# EAGLE design EIB A79024-001 (EAGLE 9.3.2)
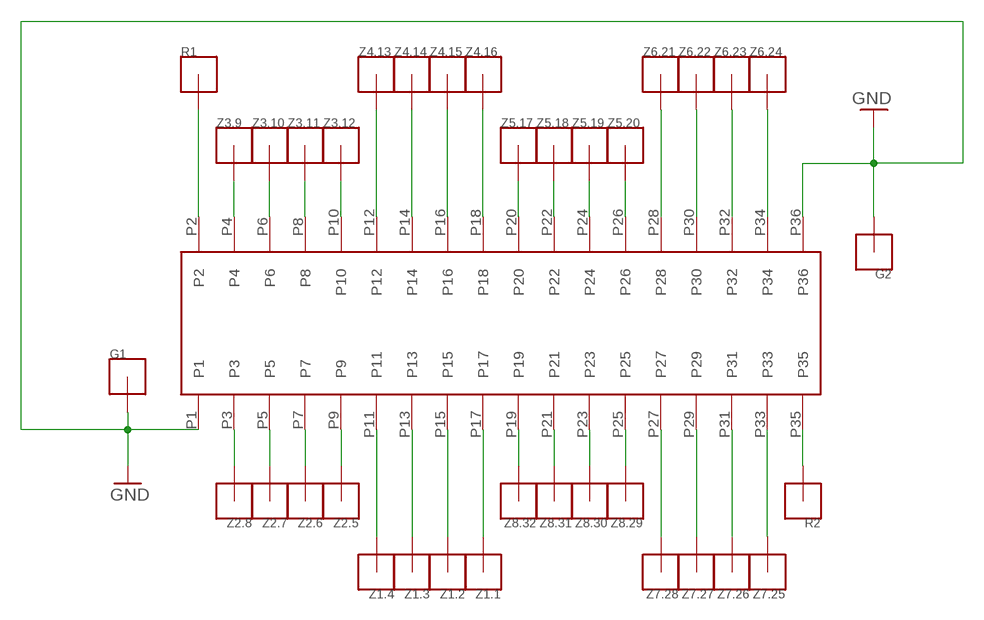
[diagram p0: schematic, sheet 1]

## Parts
A79024  OMNETICS  [A79024]
G1  S_P_HOLE  [S_P_HOLE]
G2  S_P_HOLE  [S_P_HOLE]
R1  S_P_HOLE  [S_P_HOLE]
R2  S_P_HOLE  [S_P_HOLE]
Z1.1  S_P_HOLE  [S_P_HOLE]
Z1.2  S_P_HOLE  [S_P_HOLE]
Z1.3  S_P_HOLE  [S_P_HOLE]
Z1.4  S_P_HOLE  [S_P_HOLE]
Z2.5  S_P_HOLE  [S_P_HOLE]
Z2.6  S_P_HOLE  [S_P_HOLE]
Z2.7  S_P_HOLE  [S_P_HOLE]
Z2.8  S_P_HOLE  [S_P_HOLE]
Z3.9  S_P_HOLE  [S_P_HOLE]
Z3.10  S_P_HOLE  [S_P_HOLE]
Z3.11  S_P_HOLE  [S_P_HOLE]
Z3.12  S_P_HOLE  [S_P_HOLE]
Z4.13  S_P_HOLE  [S_P_HOLE]
Z4.14  S_P_HOLE  [S_P_HOLE]
Z4.15  S_P_HOLE  [S_P_HOLE]
Z4.16  S_P_HOLE  [S_P_HOLE]
Z5.17  S_P_HOLE  [S_P_HOLE]
Z5.18  S_P_HOLE  [S_P_HOLE]
Z5.19  S_P_HOLE  [S_P_HOLE]
Z5.20  S_P_HOLE  [S_P_HOLE]
Z6.21  S_P_HOLE  [S_P_HOLE]
Z6.22  S_P_HOLE  [S_P_HOLE]
Z6.23  S_P_HOLE  [S_P_HOLE]
Z6.24  S_P_HOLE  [S_P_HOLE]
Z7.25  S_P_HOLE  [S_P_HOLE]
Z7.26  S_P_HOLE  [S_P_HOLE]
Z7.27  S_P_HOLE  [S_P_HOLE]
Z7.28  S_P_HOLE  [S_P_HOLE]
Z8.29  S_P_HOLE  [S_P_HOLE]
Z8.30  S_P_HOLE  [S_P_HOLE]
Z8.31  S_P_HOLE  [S_P_HOLE]
Z8.32  S_P_HOLE  [S_P_HOLE]

## Nets
GND: A79024.P1 A79024.P36 G1.P1 G2.P1
N$1: A79024.P28 Z6.21.P1
N$2: A79024.P32 Z6.23.P1
N$3: A79024.P34 Z6.24.P1
N$4: A79024.P30 Z6.22.P1
N$5: A79024.P4 Z3.9.P1
N$6: A79024.P6 Z3.10.P1
N$7: A79024.P8 Z3.11.P1
N$8: A79024.P10 Z3.12.P1
N$9: A79024.P12 Z4.13.P1
N$10: A79024.P14 Z4.14.P1
N$11: A79024.P16 Z4.15.P1
N$12: A79024.P18 Z4.16.P1
N$13: A79024.P20 Z5.17.P1
N$14: A79024.P22 Z5.18.P1
N$15: A79024.P24 Z5.19.P1
N$16: A79024.P26 Z5.20.P1
N$17: A79024.P2 R1.P1
N$18: A79024.P35 R2.P1
N$19: A79024.P3 Z2.8.P1
N$20: A79024.P5 Z2.7.P1
N$21: A79024.P7 Z2.6.P1
N$22: A79024.P9 Z2.5.P1
N$23: A79024.P11 Z1.4.P1
N$24: A79024.P13 Z1.3.P1
N$25: A79024.P15 Z1.2.P1
N$26: A79024.P17 Z1.1.P1
N$27: A79024.P19 Z8.32.P1
N$28: A79024.P21 Z8.31.P1
N$29: A79024.P23 Z8.30.P1
N$30: A79024.P25 Z8.29.P1
N$31: A79024.P27 Z7.28.P1
N$32: A79024.P29 Z7.27.P1
N$33: A79024.P31 Z7.26.P1
N$63: A79024.P33 Z7.25.P1

## Library data of the parts
A79024 = omnetics:OMNETICS
G1 G2 R1 R2 Z1.1-Z1.4 Z2.5-Z2.8 Z3.9-Z3.12 Z4.13-Z4.16 Z5.17-Z5.20 Z6.21-Z6.24 Z7.25-Z7.28 Z8.29-Z8.32 = omnetics:S_P_HOLE

## Board
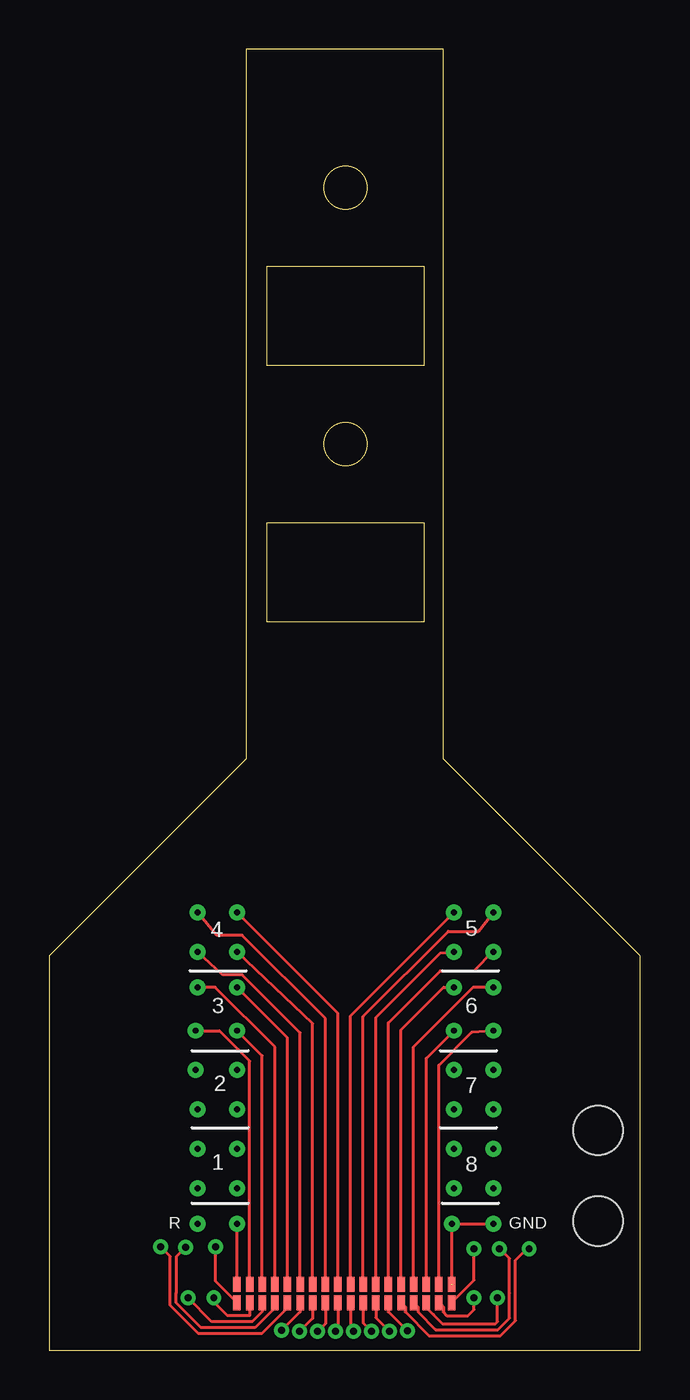
[diagram p1: board, top side]
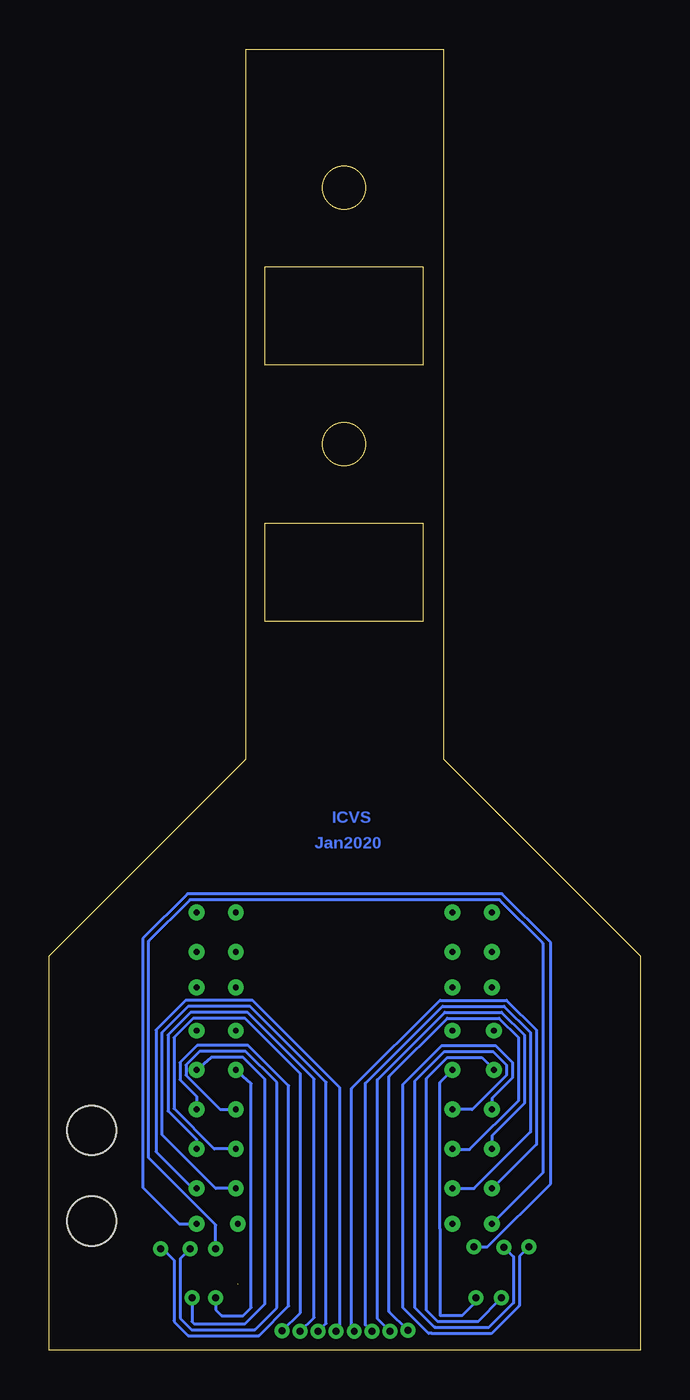
[diagram p2: board, bottom side, seen from below]

Size 30 x 66 mm. Coordinates in mm from the lower left corner, seen from the top.
Outline: 19.04,36.97 19.04,41.97 11.04,41.97 11.04,36.97 19.04,36.97
Outline: 19.04,49.97 19.04,54.97 11.04,54.97 11.04,49.97 19.04,49.97
Outline: 10,30 0,20 0,0 30,0 30,20 20,30 20,66 10,66 10,30
Outline: circle at 15.04,45.97 radius 1.1
Outline: circle at 15.04,58.97 radius 1.1
Copper layers (1*16): Top 0.035mm / dielectric 1.5mm / Bottom 0.035mm
Design rules "default": minimum track width 6mil, minimum drill 0.35mm, track to track 6mil, track to pad 6mil, pad to pad 6mil, via to via 6mil, smd to smd 6mil, copper to edge 40mil, drill to drill 6mil, minimum pad ring 10mil, minimum via ring 8mil, stop-mask expansion 4mil, vias tented up to drill 0mil, thermal gap 10mil
Holes 2.5 mm at 27.85,6.55 27.85,11.15

### Footprints (pad centres in the part's own frame; a part is rotated, then mirrored left to right if it is on the bottom)
A79024 = smd 0.38 x 0.76: P1 0,0; P2 0,0.94; P3 0.64,0; P4 0.64,0.94; P5 1.28,0; P6 1.28,0.94; P7 1.92,0; P8 1.92,0.94; P9 2.56,0; P10 2.56,0.94; P11 3.2,0; P12 3.2,0.94; P13 3.84,0; P14 3.84,0.94; P15 4.48,0; P16 4.48,0.94; P17 5.12,0; P18 5.12,0.94; P19 5.76,0; P20 5.76,0.94; P21 6.4,0; P22 6.4,0.94; P23 7.04,0; P24 7.04,0.94; P25 7.68,0; P26 7.68,0.94; P27 8.32,0; P28 8.32,0.94; P29 8.96,0; P30 8.96,0.94; P31 9.6,0; P32 9.6,0.94; P33 10.24,0; P34 10.24,0.94; P35 10.88,0; P36 10.88,0.94
S_P_HOLE = drill 0.3 pad 0.6: P1 0,0

### Placement (x,y rotation side)
A79024  9.53,2.41 0 top
G1  22.53,6.41 0 top
G2  20.43,6.41 0 top
R1  9.53,6.41 0 top
R2  7.53,6.41 0 top
Z1.1  7.53,8.21 0 top
Z1.2  9.53,8.21 0 top
Z1.3  7.53,10.21 0 top
Z1.4  9.53,10.21 0 top
Z2.5  7.53,12.21 0 top
Z2.6  9.53,12.21 0 top
Z2.7  7.43,14.21 0 top
Z2.8  9.53,14.21 0 top
Z3.9  7.43,16.21 0 top
Z3.10  9.53,16.21 0 top
Z3.11  7.53,18.41 0 top
Z3.12  9.53,18.41 0 top
Z4.13  7.53,20.21 0 top
Z4.14  9.53,20.21 0 top
Z4.15  7.53,22.21 0 top
Z4.16  9.53,22.21 0 top
Z5.17  20.53,22.21 0 top
Z5.18  22.53,22.21 0 top
Z5.19  20.53,20.21 0 top
Z5.20  22.53,20.21 0 top
Z6.21  20.53,18.41 0 top
Z6.22  22.53,18.41 0 top
Z6.23  20.53,16.21 0 top
Z6.24  22.53,16.21 0 top
Z7.25  20.53,14.21 0 top
Z7.26  22.53,14.21 0 top
Z7.27  20.53,12.21 0 top
Z7.28  22.53,12.21 0 top
Z8.29  20.53,10.21 0 top
Z8.30  22.53,10.21 0 top
Z8.31  20.53,8.21 0 top
Z8.32  22.53,8.21 0 top

### Tracks (layer width: path | path; a pad name or v marks a point on that pad's centre or on a via)
GND  (via drill 0.35)  (1 unrouted)
  Top 0.152: 20.43,3.34 20.39,3.33 | 9.49,2.45 A79024.P1 8.45,3.49 v8.45,5.25 | A79024.P36 20.43,3.37 G2.P1 G1.P1
  Bottom 0.152: v8.45,5.25 7.75,5.25 4.55,8.45 4.55,20.68 7.02,23.15 22.99,23.15 25.26,20.88 25.26,8.26 23.41,6.41 G1.P1
N$1
  Top 0.152: A79024.P28 17.85,16.25 20.01,18.41 Z6.21.P1
N$2
  Top 0.152: A79024.P32 19.13,14.81 Z6.23.P1
N$3
  Top 0.152: A79024.P34 19.77,14.46 21.43,16.11 Z6.24.P1
N$4
  Top 0.152: A79024.P30 18.49,15.39 21.51,18.41 Z6.22.P1
N$5
  Top 0.152: A79024.P4 10.17,14.68 8.64,16.21 Z3.9.P1
N$6
  Top 0.152: A79024.P6 10.81,14.93 Z3.10.P1
N$7
  Top 0.152: Z3.11.P1 8.43,18.41 11.45,15.39 A79024.P8
N$8
  Top 0.152: A79024.P10 12.09,15.85 Z3.12.P1
N$9
  Top 0.152: Z4.13.P1 8.8,19.05 9.79,19.05 12.73,16.11 A79024.P12
N$10
  Top 0.152: 13.47,3.45 A79024.P14 13.37,16.57 Z4.14.P1
N$11
  Top 0.152: Z4.15.P1 8.5,21.05 9.79,21.05 14.01,16.83 A79024.P16
N$12
  Top 0.152: A79024.P18 14.65,17.09 Z4.16.P1
N$13
  Top 0.152: A79024.P20 15.29,16.97 Z5.17.P1
N$14
  Top 0.152: A79024.P22 15.93,16.93 20.25,21.25 21.77,21.25 Z5.18.P1
N$15
  Top 0.152: A79024.P24 16.57,16.88 19.85,20.15 Z5.19.P1
N$16
  Top 0.152: A79024.P26 17.21,16.61 19.85,19.25 21.55,19.25 22.52,20.22 Z5.20.P1
N$17
  Top 0.152: A79024.P2 R1.P1
N$18  (via drill 0.35)
  Top 0.152: A79024.P35 21.55,3.55 v21.55,5.15
  Bottom 0.152: v21.55,5.15 21.55,6.35 24.95,9.75 24.95,20.75 22.86,22.85 7.14,22.85 4.95,20.65 4.95,8.99 R2.P1
N$19  (via drill 0.35)
  Top 0.152: A79024.P3 10.17,1.76 9.04,1.76 8.35,2.45 v8.35,2.65
  Bottom 0.152: v8.35,2.65 8.35,2.45 9.05,1.75 10.15,1.75 10.15,6.14 10.16,6.15 10.16,13.58 Z2.8.P1
N$20  (via drill 0.35)
  Top 0.152: A79024.P5 10.79,2.39 10.79,1.95 10.3,1.46 8.25,1.46 v7.05,2.65
  Bottom 0.152: v7.05,2.65 8.26,1.45 10.28,1.45 10.85,2.02 10.85,13.79 9.79,14.85 8.06,14.85 8.05,14.85 7.43,14.23 Z2.7.P1
N$21  (via drill 0.35)
  Top 0.152: A79024.P7 | A79024.P7 11.35,2.31 | A79024.P7 11.43,2.39 11.43,2.19 | A79024.P7 11.45,2.21 11.43,2.19 | 11.43,2.19 11.43,2.14 10.44,1.15 7.7,1.15 6.44,2.4 6.44,2.9 6.45,2.91 6.45,4.75 v6.92,5.22
  Bottom 0.152: v6.92,5.22 6.44,4.75 6.44,2.4 7.7,1.14 10.4,1.14 10.41,1.15 10.45,1.15 11.45,2.15 11.45,13.65 9.95,15.16 7.48,15.16 6.8,14.48 6.8,13.95 7.77,12.98 7.76,12.98 8.53,12.21 Z2.6.P1
N$22  (via drill 0.35)
  Top 0.152: 12.07,2.14 12.07,2.39 A79024.P9 12.09,2.11 12.07,2.09 12.07,2.14 | 12.07,2.14 10.78,0.85 7.57,0.85 6.14,2.28 6.14,4.77 v5.65,5.25
  Bottom 0.152: v5.65,5.25 6.14,4.77 6.14,2.28 6.15,2.26 6.15,2.25 7.57,0.84 10.57,0.84 10.58,0.85 10.75,0.85 12.05,2.15 12.05,13.48 10.07,15.46 7.36,15.46 6.49,14.6 6.49,13.82 7.53,12.78 Z2.5.P1
N$23  (via drill 0.35)
  Top 0.152: 12.73,2.13 A79024.P11 12.73,1.94 v11.8,1.01
  Bottom 0.152: v11.8,1.01 12.75,1.96 12.75,13.89 9.79,16.85 7.17,16.85 6.19,15.87 6.19,12.66 8.67,10.18 9.5,10.18 Z1.4.P1
N$24  (via drill 0.35)
  Top 0.152: A79024.P13 13.37,1.62 v12.71,0.95
  Bottom 0.152: v12.71,0.95 13.35,1.6 13.35,13.72 9.92,17.15 7.04,17.15 5.88,15.99 5.88,12.53 7.53,10.89 Z1.3.P1
N$25  (via drill 0.35)
  Top 0.152: A79024.P15 14.01,1.35 v13.61,0.95
  Bottom 0.152: v13.61,0.95 13.95,1.29 13.95,13.55 10.05,17.46 6.92,17.46 5.58,16.12 5.58,11.07 8.44,8.21 Z1.2.P1
N$26  (via drill 0.35)
  Top 0.152: A79024.P17 14.65,1.08 v14.52,0.95
  Bottom 0.152: v14.52,0.95 14.62,1.05 14.65,1.05 14.65,13.28 10.17,17.76 6.79,17.76 5.27,16.24 5.27,10.44 7.53,8.19 Z1.1.P1
N$27  (via drill 0.35)
  Top 0.152: A79024.P19 15.29,1.11 v15.45,0.95
  Bottom 0.152: v15.45,0.95 15.25,1.15 15.25,13.32 19.69,17.76 23.07,17.76 24.59,16.24 24.59,10.07 22.73,8.21 Z8.32.P1
N$28  (via drill 0.35)
  Top 0.152: A79024.P21 15.93,1.38 v16.36,0.95
  Bottom 0.152: v16.36,0.95 15.95,1.36 15.95,13.59 19.82,17.46 22.95,17.46 24.28,16.12 24.28,10.94 21.56,8.21 Z8.31.P1
N$29  (via drill 0.35)
  Top 0.152: A79024.P23 16.57,1.65 v17.27,0.95
  Bottom 0.152: v17.27,0.95 16.57,1.65 16.55,1.65 16.55,13.76 19.94,17.15 22.82,17.15 23.98,15.99 23.98,12.13 22.53,10.69 Z8.30.P1
N$30  (via drill 0.35)
  Top 0.152: 17.25,2.37 A79024.P25 17.21,1.94 v18.18,0.98
  Bottom 0.152: v18.18,0.98 17.25,1.9 17.25,14.03 20.07,16.85 22.69,16.85 23.67,15.87 23.67,12.26 21.63,10.21 Z8.29.P1
N$31  (via drill 0.35)
  Top 0.152: 17.85,2.15 A79024.P27 18.07,2.19 18.07,1.94 19.27,0.74 22.9,0.74 23.66,1.5 23.66,4.57 24.25,5.15 v24.35,5.15
  Bottom 0.152: Z7.28.P1 22.53,12.89 23.37,13.73 23.37,14.6 22.51,15.46 19.9,15.46 17.85,13.42 17.85,2.25 19.36,0.74 22.94,0.74 23.65,1.45 23.65,1.49 23.66,1.5 23.66,4.57 24.25,5.15 v24.35,5.15
N$32  (via drill 0.35)
  Top 0.152: 18.49,2.11 A79024.P29 18.71,2.19 18.71,1.94 19.6,1.05 22.78,1.05 23.36,1.63 23.36,2.9 23.35,2.91 23.35,4.65 v22.85,5.15
  Bottom 0.152: Z7.27.P1 21.33,12.21 23.06,13.95 23.06,14.48 22.38,15.16 20.03,15.16 18.45,13.58 18.45,2.15 19.56,1.05 22.78,1.05 23.36,1.63 23.36,4.65 v22.85,5.15
N$33  (via drill 0.35)
  Top 0.152: A79024.P31 19.13,2.16 19.49,1.8 19.5,1.8 19.95,1.35 22.65,1.35 22.75,1.45 v22.75,2.65
  Bottom 0.152: v22.75,2.65 22.75,1.45 22.65,1.35 20.05,1.35 19.05,2.35 19.05,13.75 20.15,14.85 21.79,14.85 Z7.26.P1
N$63  (via drill 0.35)
  Top 0.152: A79024.P33 19.99,2.19 19.99,1.94 20.18,1.75 21.25,1.75 21.55,2.05 v21.55,2.65
  Bottom 0.152: v21.55,2.65 21.55,2.05 21.25,1.75 20.15,1.75 19.75,2.15 19.75,13.53 Z7.25.P1

### Text on the board
Bottom: ICVS | Jan2020
tNames: 4 | 5 | 3 | 6 | 2 | 7 | 1 | 8 | R | GND